# Altium project 10033E1.PrjPcb
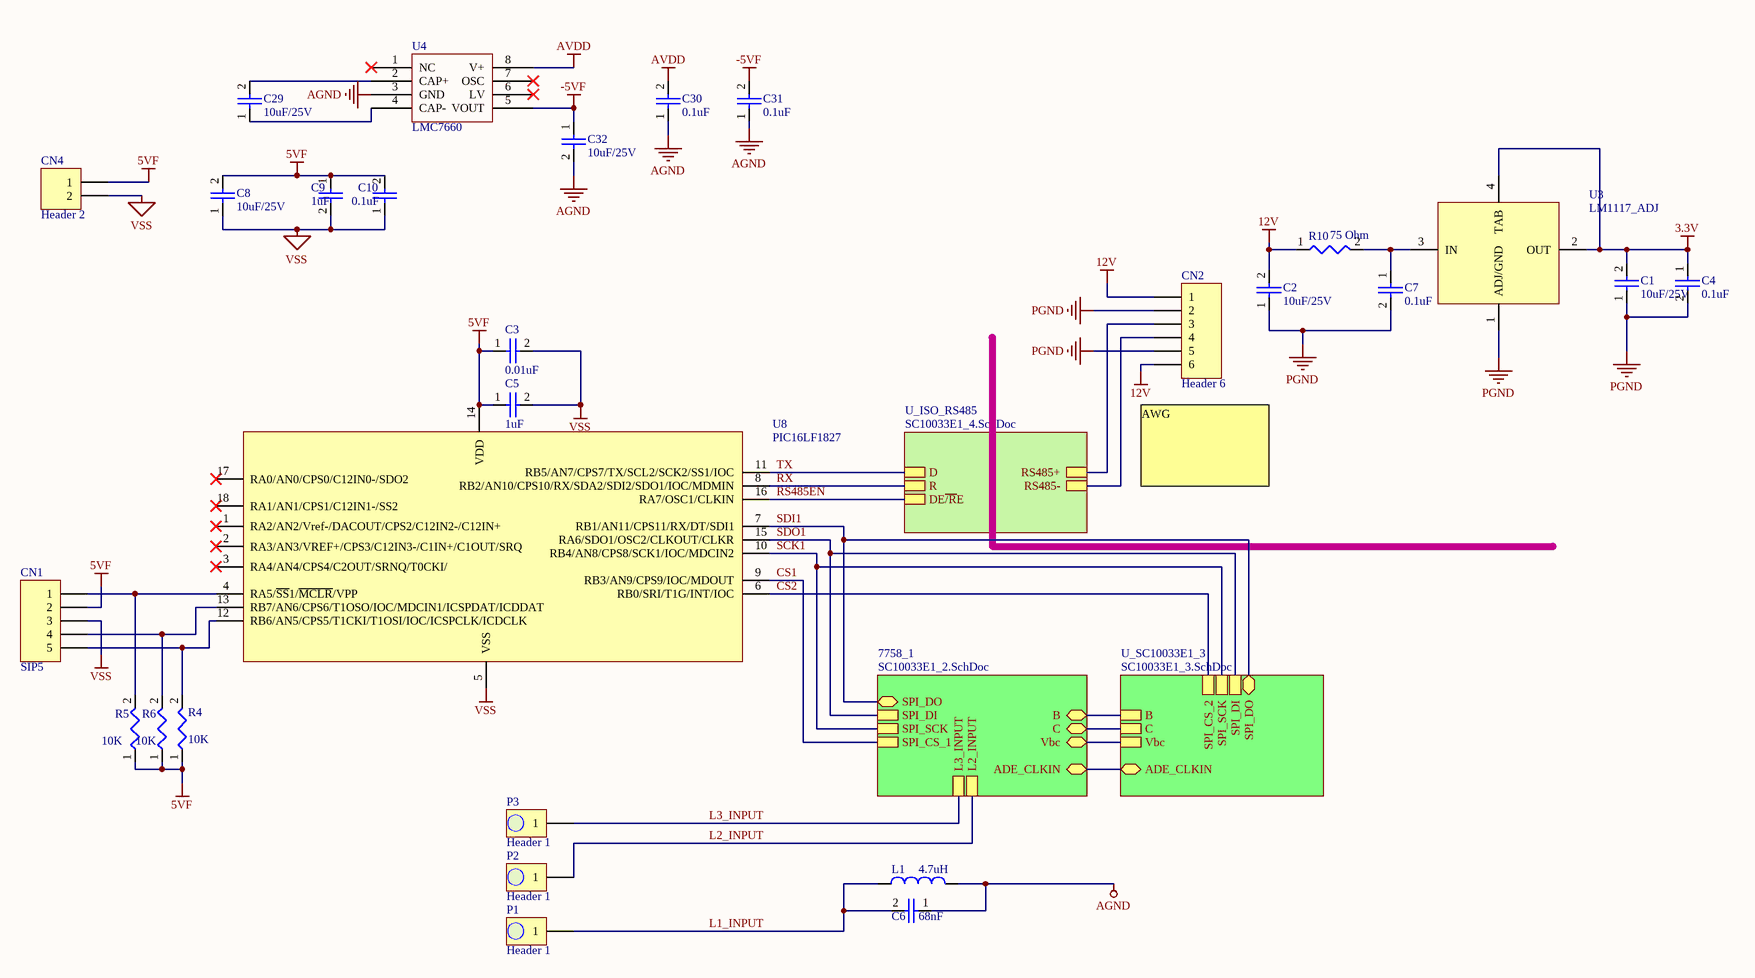
[diagram p0: SC10033E1.SchDoc]
Project: NA_Power_MeteredBoard_delta; PCB P/N: PB10033E1
4 sheets, 129 parts. Net scope: hierarchical (ports join the sheet entries above them; power ports are global).
Board file: PB10033E1.PcbDoc
Sheets:
  SC10033E1.SchDoc
    U_ISO_RS485 = SC10033E1_4.SchDoc
    7758_1 = SC10033E1_2.SchDoc
    U_SC10033E1_3 = SC10033E1_3.SchDoc

## Sheet SC10033E1.SchDoc: TOP
size A3; PCB PN: PB10013; PCBA PN: PA00013

### Parts
C1  value 10uF/25V  [C1206]  (hidden comment: CAP)
C2  value 10uF/25V  [C1206]  (hidden comment: CAP)
C3  value 0.01uF  [C0805]  (hidden comment: CAP)
C4  value 0.1uF  [C0805]  (hidden comment: CAP)
C5  value 1uF  [C0805]  (hidden comment: CAP)
C6  value 68nF  [C1206]  (hidden comment: CAP)
C7  value 0.1uF  [C0805]  (hidden comment: CAP)
C8  value 10uF/25V  [C1206]  (hidden comment: CAP)
C9  value 1uF  [C0805]  (hidden comment: CAP)
C10  value 0.1uF  [C0805]  (hidden comment: CAP)
C29  value 10uF/25V  [C1206]  (hidden comment: CAP)
C30  value 0.1uF  [C0805]  (hidden comment: CAP)
C31  value 0.1uF  [C0805]  (hidden comment: CAP)
C32  value 10uF/25V  [C1206]  (hidden comment: CAP)
CN1  SIP5  [SIP5]  (no BOM)
CN2  Header 6  [532590529-6P]
CN4  Header 2  [70551-2P]
L1  value 4.7uH  [L1008]  (hidden comment: Inductor)
P1  Header 1  (no BOM)
P2  Header 1  (no BOM)
P3  Header 1  (no BOM)
R4  value 10K  [R0603]  (hidden comment: RES)
R5  value 10K  [R0603]  (hidden comment: RES)
R6  value 10K  [R0603]  (hidden comment: RES)
R10  value 75 Ohm  [R2512]  (hidden comment: RES)
U3  LM1117_ADJ  [DPAK-134]
U4  LMC7660  [SOIC8]
U8  PIC16LF1827  [SO18]

### Sub-sheets
7758_1 = SC10033E1_2.SchDoc: L2_INPUT, L3_INPUT, SPI_DI, SPI_DO (bidir), SPI_SCK, SPI_CS_1, B, C, Vbc, ADE_CLKIN (bidir)
U_ISO_RS485 = SC10033E1_4.SchDoc: R, D, DE~{/R}E, RS485+, RS485-
U_SC10033E1_3 = SC10033E1_3.SchDoc: B, C, SPI_DI, SPI_DO (bidir), SPI_SCK, SPI_CS_2, ADE_CLKIN (bidir), Vbc

### Nets
3.3V: C1.2 C4.1 U3.2(OUT) U3.4(TAB)
5VF: C3.1 C5.1 C8.2 C9.1 C10.2 CN1.2 CN4.1 R4.1 R5.1 R6.1 U8.14(VDD)
12V: C2.2 CN2.1 CN2.6 R10.1
-5VF: C31.2 C32.1 U4.5(VOUT)
AGND: C6.1 C30.1 C31.1 C32.2 L1.2 U4.3(GND)
AVDD: C30.2 U4.8(V+)
PGND: C1.1 C2.1 C4.2 C7.2 CN2.2 CN2.5 U3.1(ADJ/GND)
VSS: C3.2 C5.2 C8.1 C9.2 C10.1 CN1.3 CN4.2 U8.5(VSS)
B: sheet 7758_1/B, sheet U_SC10033E1_3/B
C: sheet 7758_1/C, sheet U_SC10033E1_3/C
CS1: U8.9(RB3/AN9/CPS9/IOC/MDOUT) ; sheet 7758_1/SPI_CS_1
CS2: U8.6(RB0/SRI/T1G/INT/IOC) ; sheet U_SC10033E1_3/SPI_CS_2
L1_INPUT: C6.2 L1.1 P1.1
L2_INPUT: P2.1 ; sheet 7758_1/L2_INPUT
L3_INPUT: P3.1 ; sheet 7758_1/L3_INPUT
RS485EN: U8.16(RA7/OSC1/CLKIN) ; sheet U_ISO_RS485/DE~{/R}E
RX: U8.8(RB2/AN10/CPS10/RX/SDA2/SDI2/SDO1/IOC/MDMIN) ; sheet U_ISO_RS485/R
SCK1: U8.10(RB4/AN8/CPS8/SCK1/IOC/MDCIN2) ; sheet 7758_1/SPI_SCK, sheet U_SC10033E1_3/SPI_SCK
SDI1: U8.7(RB1/AN11/CPS11/RX/DT/SDI1) ; sheet 7758_1/SPI_DO, sheet U_SC10033E1_3/SPI_DO
SDO1: U8.15(RA6/SDO1/OSC2/CLKOUT/CLKR) ; sheet 7758_1/SPI_DI, sheet U_SC10033E1_3/SPI_DI
TX: U8.11(RB5/AN7/CPS7/TX/SCL2/SCK2/SS1/IOC) ; sheet U_ISO_RS485/D
Vbc: sheet 7758_1/Vbc, sheet U_SC10033E1_3/Vbc
NetC7_1: C7.1 R10.2 U3.3(IN)
NetC29_1: C29.1 U4.4(CAP-)
NetC29_2: C29.2 U4.2(CAP+)
NetC62_1: sheet 7758_1/ADE_CLKIN, sheet U_SC10033E1_3/ADE_CLKIN
NetCN1_1: CN1.1 R5.2 U8.4(RA5/~{SS}1/~{MCLR}/VPP)
NetCN1_4: CN1.4 R6.2 U8.13(RB7/AN6/CPS6/T1OSO/IOC/MDCIN1/ICSPDAT/ICDDAT)
NetCN1_5: CN1.5 R4.2 U8.12(RB6/AN5/CPS5/T1CKI/T1OSI/IOC/ICSPCLK/ICDCLK)
NetCN2_3: CN2.3 ; sheet U_ISO_RS485/RS485+
NetCN2_4: CN2.4 ; sheet U_ISO_RS485/RS485-

Not connected (* = marked no-connect by the designer): U4 1(NC)* 6(LV)* 7(OSC)*; U8 1(RA2/AN2/Vref-/DACOUT/CPS2/C12IN2-/C12IN+)* 2(RA3/AN3/VREF+/CPS3/C12IN3-/C1IN+/C1OUT/SRQ)* 3(RA4/AN4/CPS4/C2OUT/SRNQ/T0CKI/)* 17(RA0/AN0/CPS0/C12IN0-/SDO2)* 18(RA1/AN1/CPS1/C12IN1-/SS2)*

### Notes on the sheet
- (near CN2) AWG

### Library data of the parts
C1 C2 C8 C29 C32 = EC00088: CAP,CMCC,10uF,25V,10%,X7R,1206,SMD,ROHS; Manufacturer: Murata; Manufacturer P/N: GRM31CR71E106KA12L; ID: 88; Type: ****; HelpURL: \\192.168.1.3\Esh\Department\RD\CAD\Component\Capacitor\smd\Murata_GRM31CR71E106KA12L.pdf; P/N: EC00088
C3 = EC00018: CAP SMD CR X7R 50V 10% 10nF 0805 ROHS; Manufacturer: Murata; Manufacturer P/N: GRM216R71H103KA01D; ID: 18; HelpURL: *; P/N: EC00018
C4 C7 C10 = EC00078: CAP SMD CR X7R 50V 10% 0.1uF 0805 ROHS; Manufacturer: Murata; Manufacturer P/N: GRM21BR71H104KA01; ID: 78; Type: ****; HelpURL: \\192.168.1.3\Esh\Department\RD\CAD\Component\Capacitor\smd\Murata_GRM21BR71H104KA01#.pdf; P/N: EC00078
C5 = EC00002: CAP SMD CR X7R 50V 10% 1uF 0805 ROHS; Manufacturer: YAGEO; Manufacturer P/N: CC0805KKX7R9BB105; ID: 2; HelpURL: *; P/N: EC00002
C6 = EC00059: CAP SMD C0G 50V 5% 68nF 1206 ROHS; Manufacturer: Murata; Manufacturer P/N: GRM31C5C1H683JA01L; ID: 59; HelpURL: *; P/N: EC00059
C9 = EC00055: CAP SMD CR X7R 50V 10% 1uF 0805 ROHS; Manufacturer: Murata; Manufacturer P/N: GRM21BR71H105KA12L; ID: 55; HelpURL: *; P/N: EC00055
C30 C31 = EC00014: CAP SMD CR X7R 50V 10% 0.1uF 0805 ROHS; Manufacturer: YAGEO; Manufacturer P/N: CC0805KRX7R9BB104; ID: 14; HelpURL: *; P/N: EC00014
CN1 = EJ00017: CONNECTOR 5PIN,2.54PITCH,SIP-5; Manufacturer: 信荣; Manufacturer P/N: PH2.54*1*5*11.6/3.0; ID: 17; P/N: EJ00017; Value: SIP-5
CN2 = EJ00053: CONNECTOR 6PIN,3.5PITCH,PTH,ROHS; Manufacturer P/N: 532590629; Manufacturer: MOLEX; ID: 53; Value: 532590629; HelpURL: \\192.168.1.3\Esh\Department\RD\CAD\Component\connector\molex\532590529_sd.pdf; P/N: EJ00053; Type: *****
CN4 = EJ00051: CONNECTOR 2PIN,2.54PITCH,90 Degrees,PTH; Manufacturer P/N: 705510001; Manufacturer: MOLEX; ID: 51; Value: 705510001; HelpURL: \\192.168.1.3\Esh\Department\RD\CAD\Component\connector\molex\705510004.pdf; P/N: EJ00051
L1 = EL00009: INDUCTOR 4.7uH 0.45A 5%,SRF = 50MHz,Q = 26, SMD 1008 ROHS; Manufacturer: Wuerth Electronic; Manufacturer P/N: 74479887247; ID: 9; Type: ****; HelpURL: \\192.168.1.3\Esh\Department\RD\CAD\Component\Inductor\WE_74479887247.pdf; P/N: EL00009
P1-P3 = Header 1: Header, 1-Pin
R4-R6 = ER00213: RES THICK_FILM SMD 10K ohm 5% 1/10W ROHS 0603; Manufacturer: YAGEO; Manufacturer P/N: RC0603JR-1310KL; ID: 213; HelpURL: \\192.168.1.3\Esh\Department\RD\CAD\Component\Resistor\SMD\YAGEO_PYu-RC1206_51_RoHS_L_4.pdf; P/N: ER00213
R10 = ER00212: RES THICK_FILM SMD 75 ohm 5% 1W ROHS 2512; Manufacturer: YAGEO; Manufacturer P/N: RC2512JK-0775RL; ID: 212; HelpURL: \\192.168.1.3\Esh\Department\RD\CAD\Component\Resistor\SMD\YAGEO_PYu-RC1206_51_RoHS_L_4.pdf; P/N: ER00212
U3 = EU00066: IC REG VOLT +3.3V LDO 800MA DPAK ROHS; Manufacturer P/N: LD1117DT33TR; Manufacturer: ST; ID: 66; Value: LD1117-3.3; HelpURL: \\192.168.1.3\Esh\Department\RD\CAD\Component\Power_DC_to_DC\LD1117_ST.pdf; P/N: EU00066; Type: *****
U4 = EU00046: IC CMOS Voltage Converters; Manufacturer P/N: LMC7660IM; Manufacturer: National Semiconductor; ID: 46; Value: LMC7660IM; HelpURL: \\192.168.1.3\Esh\Department\RD\CAD\Component\Power_DC_to_DC\LMC7660.pdf; P/N: EU00046; Type: *****
U8 = EU00033: IC 8-bit UART SPI I2C,SOIC18-W,SMD,ROHS; Manufacturer P/N: PIC16F1827-I/SO; Manufacturer: Microchip; ID: 33; Value: PIC16F1827-I/SO; HelpURL: \\192.168.1.3\Esh\Department\RD\CAD\Component\MCU\PIC16F1827.pdf; P/N: EU00033; Type: *****

## Sheet SC10033E1_4.SchDoc
size A4
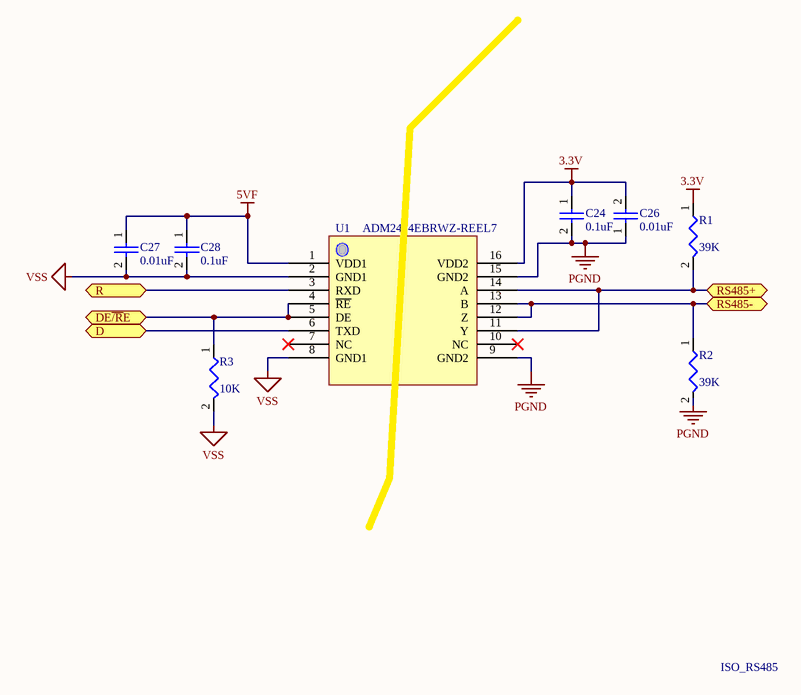
[diagram p1: SC10033E1_4.SchDoc]

### Parts
C24  value 0.1uF  [C0805]  (hidden comment: CAP)
C26  value 0.01uF  [C0805]  (hidden comment: CAP)
C27  value 0.01uF  [C0805]  (hidden comment: CAP)
C28  value 0.1uF  [C0805]  (hidden comment: CAP)
R1  value 39K  [R0805]  (hidden comment: RES)
R2  value 39K  [R0805]  (hidden comment: RES)
R3  value 10K  [R0805]  (hidden comment: RES)
U1  value ADM2484EBRWZ-REEL7  [SOIC16]  (hidden comment: ADM2484E)

### Ports
D, DE~{/R}E, R, RS485+, RS485-

### Nets
3.3V: C24.1 C26.2 R1.1 U1.16(VDD2)
5VF: C27.1 C28.1 U1.1(VDD1)
PGND: C24.2 C26.1 R2.2 U1.9(GND2) U1.15(GND2)
VSS: C27.2 C28.2 R3.2 U1.2(GND1) U1.8(GND1)
RS485EN: R3.1 U1.4(~{RE}) U1.5(DE) ; port DE~{/R}E
RX: U1.3(RXD) ; port R
TX: U1.6(TXD) ; port D
NetCN2_3: R1.2 U1.11(Y) U1.14(A) ; port RS485+
NetCN2_4: R2.1 U1.12(Z) U1.13(B) ; port RS485-

Not connected (* = marked no-connect by the designer): U1 7(NC)* 10(NC)*

### Notes on the sheet
- ISO_RS485

### Library data of the parts
C24 C28 = EC00014: as C30 on sheet SC10033E1; HelpURL: *; P/N: EC00014
C26 C27 = EC00037: CAP SMD X7R 50V 10% 10nF 0805 ROHS; Manufacturer: YAGEO; Manufacturer P/N: CC0805KRX7R9BB103; ID: 37; HelpURL: *; P/N: EC00037
R1 R2 = ER00021: RES THICK_FILM SMD 39K 5% 1/8W ROHS 0805; Manufacturer: YAGEO; Manufacturer P/N: RC0805JR-0739KL; ID: 21; HelpURL: *; P/N: ER00021
R3 = ER00031: RES THICK_FILM SMD 10K 5% 1/8W ROHS 0805; Manufacturer: YAGEO; Manufacturer P/N: RC0805JR-0710KL; ID: 31; HelpURL: *; P/N: ER00031
U1 = EU00059: IC Isolated, RS-485/RS-422 transceiver,5kV,SOIC16_W,ROHS; Manufacturer: Analog Devices; Pin Number: 16; ID: 59; HelpURL: \\192.168.1.3\Esh\Department\RD\CAD\Component\RS485\ADM2484E.pdf; P/N: EU00059; Manufacturer P/N: ADM2484EBRWZ-REEL7; Type: *****

## Sheet SC10033E1_2.SchDoc: Meter_1
size A3
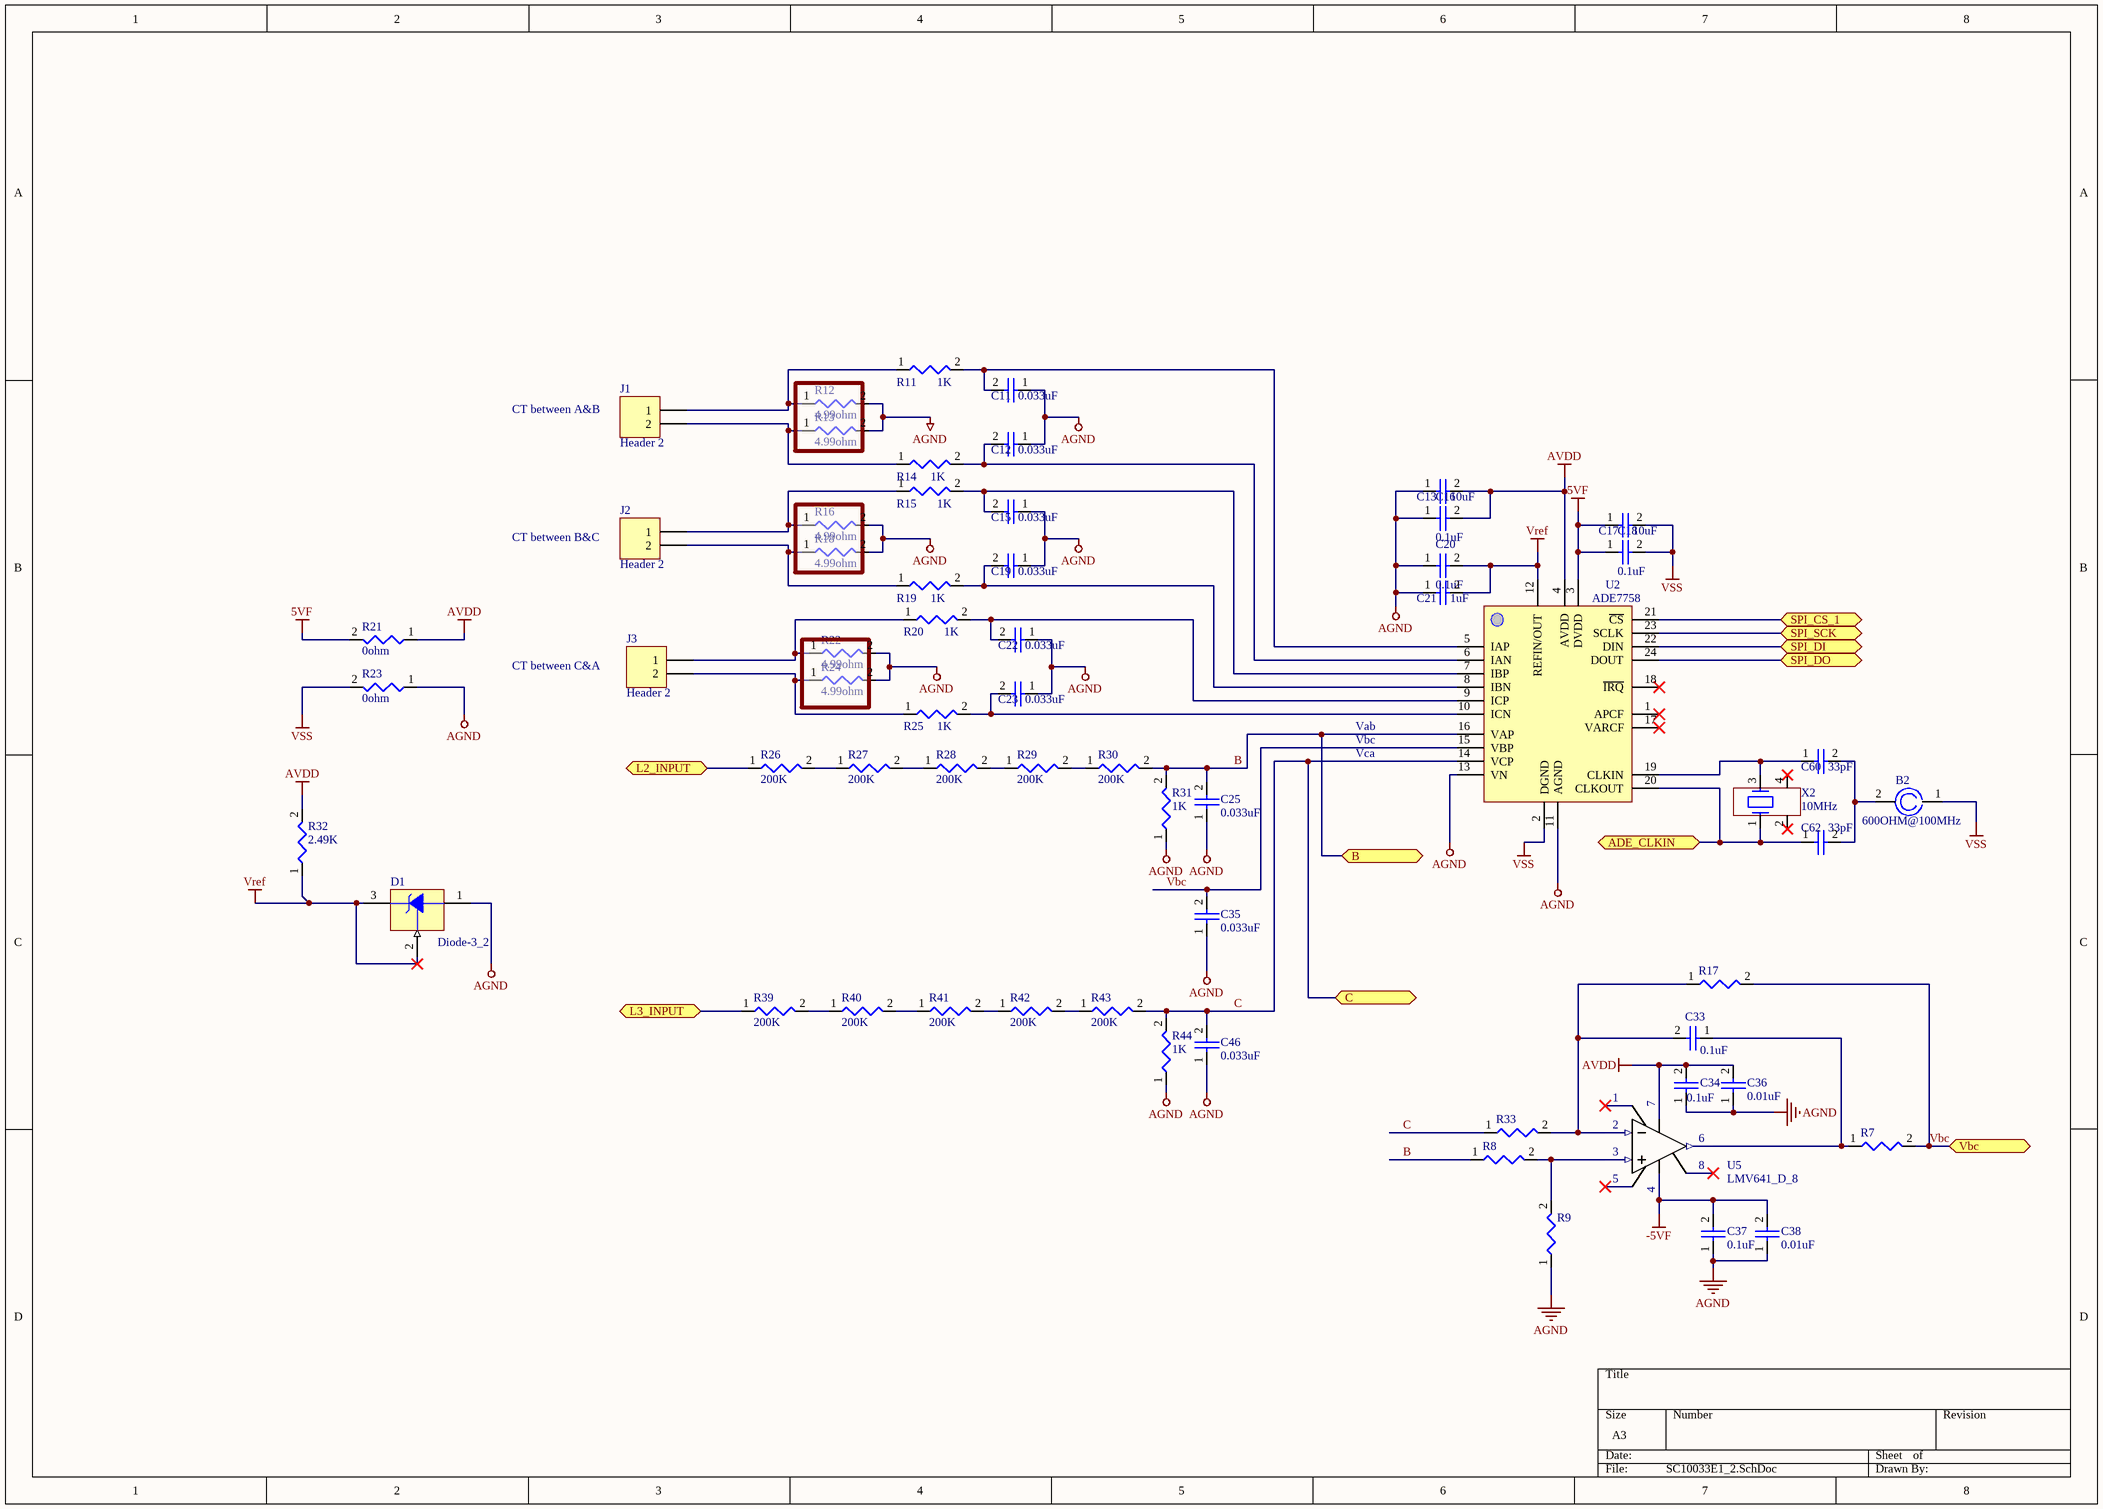
[diagram p2: SC10033E1_2.SchDoc]

### Parts
B2  value 600OHM@100MHz  [L0805]  (hidden comment: FERRITE)
C11  value 0.033uF  [C0805]  (hidden comment: CAP)
C12  value 0.033uF  [C0805]  (hidden comment: CAP)
C13  10uF  [C0805]
C15  value 0.033uF  [C0805]  (hidden comment: CAP)
C16  value 0.1uF  [C0805]  (hidden comment: CAP)
C17  10uF  [C0805]
C18  value 0.1uF  [C0805]  (hidden comment: CAP)
C19  value 0.033uF  [C0805]  (hidden comment: CAP)
C20  value 0.1uF  [C0805]  (hidden comment: CAP)
C21  value 1uF  [C0805]  (hidden comment: CAP)
C22  value 0.033uF  [C0805]  (hidden comment: CAP)
C23  value 0.033uF  [C0805]  (hidden comment: CAP)
C25  value 0.033uF  [C0805]  (hidden comment: CAP)
C33  value 0.1uF  [C0805]  (hidden comment: CAP)  (no BOM)
C34  value 0.1uF  [C0805]  (hidden comment: CAP)
C35  value 0.033uF  [C0805]  (hidden comment: CAP)
C36  value 0.01uF  [C0805]  (hidden comment: CAP)
C37  value 0.1uF  [C0805]  (hidden comment: CAP)
C38  value 0.01uF  [C0805]  (hidden comment: CAP)
C46  value 0.033uF  [C0805]  (hidden comment: CAP)
C60  value 33pF  [C0805]  (hidden comment: CAP)
C62  value 33pF  [C0805]  (hidden comment: CAP)
D1  Diode-3_2  [SOT23-321]
J1  Header 2  [533980271_sd]
J2  Header 2  [533980271_sd]
J3  Header 2  [533980271_sd]
R7  RES  [R0805]  (value not drawn)
R8  RES  [R0603]  (value not drawn)
R9  RES  [R0603]  (value not drawn)
R11  value 1K  [R0805]  (hidden comment: RES)
R12  value 4.99ohm  [R0805]  (hidden comment: RES)
R13  value 4.99ohm  [R0805]  (hidden comment: RES)
R14  value 1K  [R0805]  (hidden comment: RES)
R15  value 1K  [R0805]  (hidden comment: RES)
R16  value 4.99ohm  [R0805]  (hidden comment: RES)
R17  RES  [R0603]  (value not drawn)
R18  value 4.99ohm  [R0805]  (hidden comment: RES)
R19  value 1K  [R0805]  (hidden comment: RES)
R20  value 1K  [R0805]  (hidden comment: RES)
R21  value 0ohm  [R0805]  (hidden comment: RES)
R22  value 4.99ohm  [R0805]  (hidden comment: RES)
R23  value 0ohm  [R0805]  (hidden comment: RES)
R24  value 4.99ohm  [R0805]  (hidden comment: RES)
R25  value 1K  [R0805]  (hidden comment: RES)
R26  value 200K  [R0805]  (hidden comment: RES)
R27  value 200K  [R0805]  (hidden comment: RES)
R28  value 200K  [R0805]  (hidden comment: RES)
R29  value 200K  [R0805]  (hidden comment: RES)
R30  value 200K  [R0805]  (hidden comment: RES)
R31  value 1K  [R0805]  (hidden comment: RES)
R32  value 2.49K  [R0805]  (hidden comment: RES)
R33  RES  [R0603]  (value not drawn)
R39  value 200K  [R0805]  (hidden comment: RES)
R40  value 200K  [R0805]  (hidden comment: RES)
R41  value 200K  [R0805]  (hidden comment: RES)
R42  value 200K  [R0805]  (hidden comment: RES)
R43  value 200K  [R0805]  (hidden comment: RES)
R44  value 1K  [R0805]  (hidden comment: RES)
U2  ADE7758  [SOIC24-W]
U5  LMV641_D_8  [M08A]
X2  value 10MHz  [XTAL_5X3_2]  (hidden comment: ABM3C)

### Ports
ADE_CLKIN (bidir), B, C, L2_INPUT, L3_INPUT, SPI_CS_1, SPI_DI, SPI_DO (bidir), SPI_SCK, Vbc

### Nets
5VF: C17.1 C18.1 R21.2 U2.3(DVDD)
-5VF: C37.2 C38.2 U5.4(V-)
AGND: C11.1 C12.1 C13.1 C15.1 C16.1 C19.1 C20.1 C21.1 C22.1 C23.1 C25.1 C34.1 C35.1 C36.1 C37.1 C38.1 C46.1 D1.1(A) R9.1 R12.2 R13.2 R16.2 R18.2 R22.2 R23.1 R24.2 R31.1 R44.1 U2.11(AGND) U2.13(VN)
AVDD: C13.2 C16.2 C34.2 C36.2 R21.1 R32.2 U2.4(AVDD) U5.7(V+)
Vref: C20.2 C21.2 D1.2(R) D1.3(C) R32.1 U2.12(REFIN/OUT)
VSS: B2.1 C17.2 C18.2 R23.2 U2.2(DGND)
B: C25.2 R8.1 R30.2 R31.2 U2.16(VAP) ; port B
C: C46.2 R33.1 R43.2 R44.2 U2.14(VCP) ; port C
CS1: U2.21(~{CS}) ; port SPI_CS_1
L2_INPUT: R26.1 ; port L2_INPUT
L3_INPUT: R39.1 ; port L3_INPUT
SCK1: U2.23(SCLK) ; port SPI_SCK
SDI1: U2.24(DOUT) ; port SPI_DO
SDO1: U2.22(DIN) ; port SPI_DI
Vbc: C35.2 R7.2 R17.2 U2.15(VBP) ; port Vbc
NetB2_2: B2.2 C60.2 C62.2
NetC11_2: C11.2 R11.2 U2.5(IAP)
NetC12_2: C12.2 R14.2 U2.6(IAN)
NetC15_2: C15.2 R15.2 U2.7(IBP)
NetC19_2: C19.2 R19.2 U2.8(IBN)
NetC22_2: C22.2 R20.2 U2.9(ICP)
NetC23_2: C23.2 R25.2 U2.10(ICN)
NetC33_1: C33.1 R7.1 U5.6(OUT)
NetC33_2: C33.2 R17.1 R33.2 U5.2(IN-)
NetC60_1: C60.1 U2.19(CLKIN) X2.3
NetC62_1: C62.1 U2.20(CLKOUT) X2.1 ; port ADE_CLKIN
NetJ1_1: J1.1 R11.1 R12.1
NetJ1_2: J1.2 R13.1 R14.1
NetJ2_1: J2.1 R15.1 R16.1
NetJ2_2: J2.2 R18.1 R19.1
NetJ3_1: J3.1 R20.1 R22.1
NetJ3_2: J3.2 R24.1 R25.1
NetR8_2: R8.2 R9.2 U5.3(IN+)
NetR26_2: R26.2 R27.1
NetR27_2: R27.2 R28.1
NetR28_2: R28.2 R29.1
NetR29_2: R29.2 R30.1
NetR39_2: R39.2 R40.1
NetR40_2: R40.2 R41.1
NetR41_2: R41.2 R42.1
NetR42_2: R42.2 R43.1

Not connected (* = marked no-connect by the designer): U2 1(APCF)* 17(VARCF)* 18(~{IRQ})*; U5 1(NC)* 5(NC_3)* 8(NC_2)*; X2 2* 4*

### Notes on the sheet
- CT between A&B
- CT between B&C
- CT between C&A
- Vab
- Vbc
- Vca

### Library data of the parts
B2 = EL00002: Ferrite Bead 600OHM@100MHz 200mA SMD 0805 ROHS; Manufacturer: Wuerth Electronic; Manufacturer P/N: 742792041; ID: 2; HelpURL: \\192.168.1.3\Esh\Department\RD\CAD\Component\Ferrite Bead\WE_742792041.pdf; P/N: EL00002; Type: ****
C11 C12 C15 C19 C22 C23 C25 C35 C46 = EC00079: CAP SMD X7R 50V 10% 0.033uF 0805 ROHS; Manufacturer: Murata; Manufacturer P/N: GRM219R71H333KA01; ID: 79; HelpURL: \\192.168.1.3\Esh\Department\RD\CAD\Component\Capacitor\smd\Murata_mpdf.pdf; P/N: EC00079
C13 C17 = EC00034: CAP SMD CR X5R 16V 10% 10uF 0805 ROHS; Manufacturer: Murata; Manufacturer P/N: GRM21BR61C106KE15; Value: 10uF_16V; ID: 34; Type: ****; HelpURL: *; P/N: EC00034
C16 C18 C20 = EC00014: as C30 on sheet SC10033E1; HelpURL: *; P/N: EC00014
C21 = EC00002: as C5 on sheet SC10033E1; HelpURL: *; P/N: EC00002
C33 C34 C37 = EC00078: as C4 on sheet SC10033E1; HelpURL: \\192.168.1.3\Esh\Department\RD\CAD\Component\Capacitor\smd\Murata_GRM21BR71H104KA01#.pdf; P/N: EC00078
C36 C38 = EC00018: as C3 on sheet SC10033E1; HelpURL: *; P/N: EC00018
C60 C62 = EC00017: CAP SMD C0G 50V 5% 33pF 0805 ROHS; Manufacturer: YAGEO; Manufacturer P/N: CC0805JRNPO9BN330; ID: 17; HelpURL: \\192.168.1.3\Esh\Department\RD\CAD\Component\Capacitor\smd\Murata_GQM2195C1H330JB01D.pdf; P/N: EC00017
D1 = EU00043: IC PROGRAMMABLE PRECISION REFERENCES,2.5-20V,0.5%,SMD,ROHS; Manufacturer: DIODES; Manufacturer P/N: ZTL431BFTA; ID: 43; Value: ZTL431BFTA; Type: *****; HelpURL: \\192.168.1.3\Esh\Department\RD\CAD\Component\TL431\ZTL431_432.pdf; P/N: EU00043
J1-J3 = EJ00039: CONNECTOR 1.25mm Pitch Header, Surface Mount, Vertical, Lead-Free, 2 Circuits; Manufacturer: MOLEX; ID: 39; Value: 533980271; HelpURL: \\192.168.1.3\Esh\Department\RD\CAD\Component\connector\molex\533980271_sd.pdf; P/N: EJ00039; Manufacturer P/N: 533980271
R7 = ER00026: RES THICK_FILM SMD 0 OHM 5% 1/8W ROHS 0805; Manufacturer: YAGEO; Manufacturer P/N: RC0805JR-070RL; Value: 0ohm; ID: 26; HelpURL: *; P/N: ER00026
R8 R9 R17 R33 = ER00211: RES THIN_FILM SMD 10K 0.1% 1/10W ±25ppm/℃ ROHS 0603; Manufacturer: YAGEO; Manufacturer P/N: RT0603BRD0710KL; ID: 211; HelpURL: \\192.168.1.3\Esh\Department\RD\CAD\Component\Resistor\SMD\YAGEO_PYu-RT_1-to-0.05_RoHS_L_4.pdf; Value: 10K; P/N: ER00211
R11 R14 R15 R19 R20 R25 = ER00028: RES THICK_FILM SMD 1K 1% 1/8W ROHS 0805; Manufacturer: YAGEO; Manufacturer P/N: RC0805FR-071KL; ID: 28; HelpURL: *; P/N: ER00028
R12 R13 R16 R18 R22 R24 = ER00201: RES THIN_FILM SMD 4.99 ohm 0.1% 1/8W ±25ppm/℃ ROHS 0805; Manufacturer: YAGEO; Manufacturer P/N: RT0805BRD074R99L; ID: 201; HelpURL: *; P/N: ER00201
R21 R23 = ER00026: RES THICK_FILM SMD 0 OHM 5% 1/8W ROHS 0805; Manufacturer: YAGEO; Manufacturer P/N: RC0805JR-070RL; ID: 26; HelpURL: *; P/N: ER00026
R26-R30 R39-R43 = ER00036: RES THIN_FILM SMD 200K 0.1% 1/8W 25PPM ROHS 0805; Manufacturer: YAGEO; Manufacturer P/N: RT0805BRD07200KL; ID: 36; HelpURL: *; P/N: ER00036
R31 R44 = ER00110: RES THIN_FILM 1K 0.1% 1/8W ±25ppm/℃ ROHS SMD 0805; Manufacturer: YAGEO; Manufacturer P/N: RT0805BRD071KL; ID: 110; HelpURL: \\192.168.1.3\Esh\Department\RD\CAD\Component\Resistor\SMD\YAGEO_PYu-RT_1-to-0.05_RoHS_L_4.pdf; P/N: ER00110
R32 = ER00108: RES THICK_FILM 2.49K 1% 1/8W ROHS SMD 0805; Manufacturer: YAGEO; Manufacturer P/N: RC0805FR-072K49L; ID: 108; HelpURL: *; P/N: ER00108
U2 = EU00042: IC Energy Measurement,Irms,VA,VAR,Vrms,Watt,Output:Pulsed&SPI,SOIC_W-24,ROHS; Manufacturer P/N: ADE7758ARWZRL; Manufacturer: ANALOG DEVICES; ID: 42; Value: ADE7758ARWZRL; HelpURL: \\192.168.1.3\Esh\Department\RD\CAD\Component\Energy Measurement\ADE7758.pdf; P/N: EU00042; Type: *****
U5 = EU00065: Op Amp,10MHz,12V,Low Power,SOIC-8,RoHS; Manufacturer P/N: LMV641MAE/NOPB; Manufacturer: TI; ID: 65; Value: LMV641MAE/NOPB; HelpURL: \\192.168.1.3\Esh\Department\RD\CAD\Component\OP\lmv641.pdf; P/N: EU00065; Type: *****
X2 = EX00008: XTAL 10MHz 18PF +/-30PPM,3.2mmWx5mmLx1.3mmH,-40~85,RoHS,SMD; Manufacturer: ABRACON; Manufacturer P/N: ABM3C-10.000MHZ-D4Y-T; ID: 8; HelpURL: \\192.168.1.3\Esh\Department\RD\CAD\Component\Crystal\abracon_abm3c.pdf; P/N: EX00008; Type: *****

## Sheet SC10033E1_3.SchDoc: Meter_2
size A3
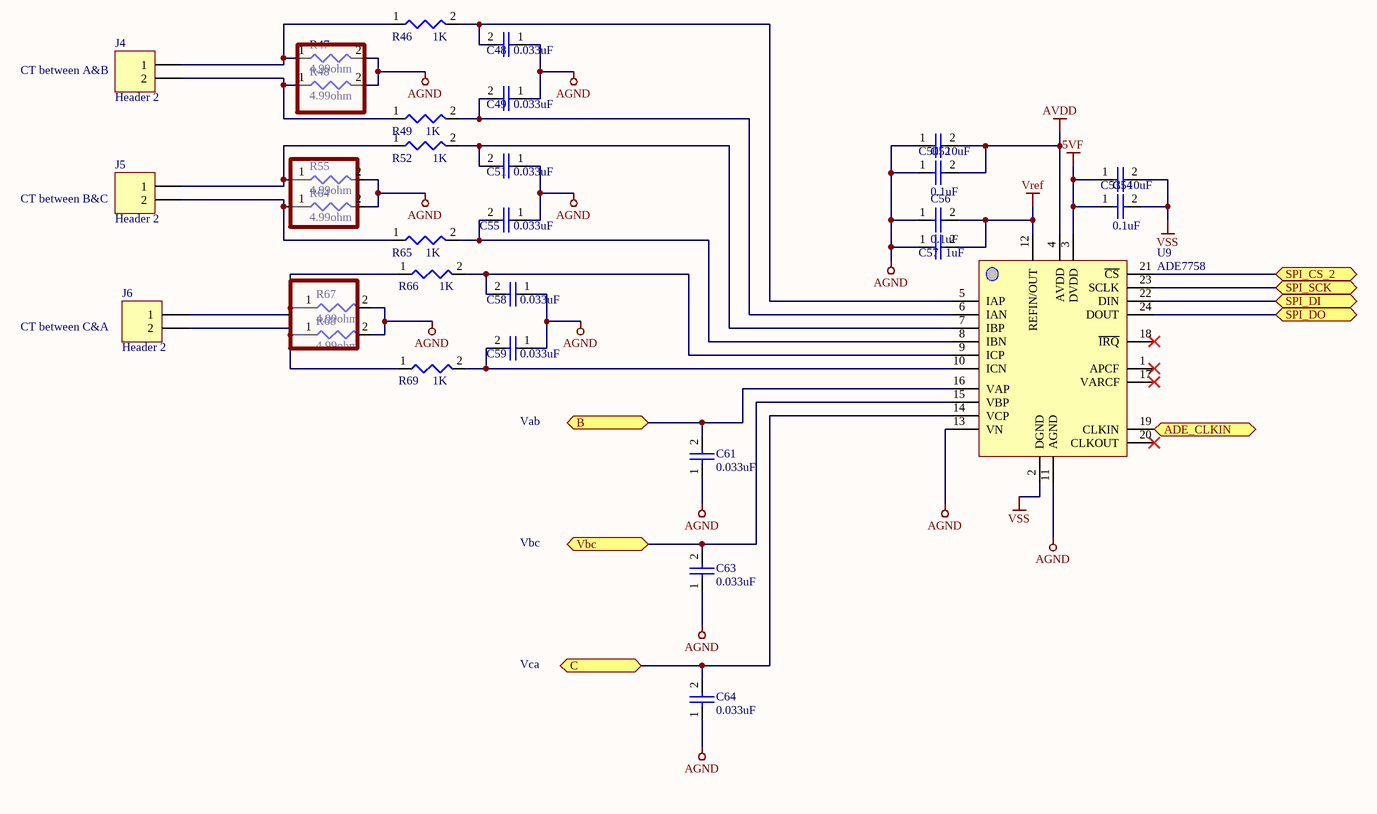
[diagram p3: SC10033E1_3.SchDoc]

### Parts
C48  value 0.033uF  [C0805]  (hidden comment: CAP)
C49  value 0.033uF  [C0805]  (hidden comment: CAP)
C50  10uF  [C0805]
C51  value 0.033uF  [C0805]  (hidden comment: CAP)
C52  value 0.1uF  [C0805]  (hidden comment: CAP)
C53  10uF  [C0805]
C54  value 0.1uF  [C0805]  (hidden comment: CAP)
C55  value 0.033uF  [C0805]  (hidden comment: CAP)
C56  value 0.1uF  [C0805]  (hidden comment: CAP)
C57  value 1uF  [C0805]  (hidden comment: CAP)
C58  value 0.033uF  [C0805]  (hidden comment: CAP)
C59  value 0.033uF  [C0805]  (hidden comment: CAP)
C61  value 0.033uF  [C0805]  (hidden comment: CAP)
C63  value 0.033uF  [C0805]  (hidden comment: CAP)
C64  value 0.033uF  [C0805]  (hidden comment: CAP)
J4  Header 2  [533980271_sd]
J5  Header 2  [533980271_sd]
J6  Header 2  [533980271_sd]
R46  value 1K  [R0805]  (hidden comment: RES)
R47  value 4.99ohm  [R0805]  (hidden comment: RES)
R48  value 4.99ohm  [R0805]  (hidden comment: RES)
R49  value 1K  [R0805]  (hidden comment: RES)
R52  value 1K  [R0805]  (hidden comment: RES)
R55  value 4.99ohm  [R0805]  (hidden comment: RES)
R64  value 4.99ohm  [R0805]  (hidden comment: RES)
R65  value 1K  [R0805]  (hidden comment: RES)
R66  value 1K  [R0805]  (hidden comment: RES)
R67  value 4.99ohm  [R0805]  (hidden comment: RES)
R68  value 4.99ohm  [R0805]  (hidden comment: RES)
R69  value 1K  [R0805]  (hidden comment: RES)
U9  ADE7758  [SOIC24-W]

### Ports
ADE_CLKIN (bidir), B, C, SPI_CS_2, SPI_DI, SPI_DO (bidir), SPI_SCK, Vbc

### Nets
5VF: C53.1 C54.1 U9.3(DVDD)
AGND: C48.1 C49.1 C50.1 C51.1 C52.1 C55.1 C56.1 C57.1 C58.1 C59.1 C61.1 C63.1 C64.1 R47.2 R48.2 R55.2 R64.2 R67.2 R68.2 U9.11(AGND) U9.13(VN)
AVDD: C50.2 C52.2 U9.4(AVDD)
Vref: C56.2 C57.2 U9.12(REFIN/OUT)
VSS: C53.2 C54.2 U9.2(DGND)
B: C61.2 U9.16(VAP) ; port B
C: C64.2 U9.14(VCP) ; port C
CS2: U9.21(~{CS}) ; port SPI_CS_2
SCK1: U9.23(SCLK) ; port SPI_SCK
SDI1: U9.24(DOUT) ; port SPI_DO
SDO1: U9.22(DIN) ; port SPI_DI
Vbc: C63.2 U9.15(VBP) ; port Vbc
NetC48_2: C48.2 R46.2 U9.5(IAP)
NetC49_2: C49.2 R49.2 U9.6(IAN)
NetC51_2: C51.2 R52.2 U9.7(IBP)
NetC55_2: C55.2 R65.2 U9.8(IBN)
NetC58_2: C58.2 R66.2 U9.9(ICP)
NetC59_2: C59.2 R69.2 U9.10(ICN)
NetC62_1: U9.19(CLKIN) ; port ADE_CLKIN
NetJ4_1: J4.1 R46.1 R47.1
NetJ4_2: J4.2 R48.1 R49.1
NetJ5_1: J5.1 R52.1 R55.1
NetJ5_2: J5.2 R64.1 R65.1
NetJ6_1: J6.1 R66.1 R67.1
NetJ6_2: J6.2 R68.1 R69.1

Not connected (* = marked no-connect by the designer): U9 1(APCF)* 17(VARCF)* 18(~{IRQ})* 20(CLKOUT)*

### Notes on the sheet
- (near J4) CT between A&B
- (near J5) CT between B&C
- CT between C&A
- Vab
- Vbc
- Vca

### Library data of the parts
C48 C49 C51 C55 C58 C59 C61 C63 C64 = EC00079: as C11 on sheet SC10033E1_2; HelpURL: \\192.168.1.3\Esh\Department\RD\CAD\Component\Capacitor\smd\Murata_mpdf.pdf; P/N: EC00079
C50 C53 = EC00034: as C13 on sheet SC10033E1_2; HelpURL: *; P/N: EC00034
C52 C54 C56 = EC00014: as C30 on sheet SC10033E1; HelpURL: *; P/N: EC00014
C57 = EC00002: as C5 on sheet SC10033E1; HelpURL: *; P/N: EC00002
J4-J6 = EJ00039: as J1 on sheet SC10033E1_2; HelpURL: \\192.168.1.3\Esh\Department\RD\CAD\Component\connector\molex\533980271_sd.pdf; P/N: EJ00039; Manufacturer P/N: 533980271
R46 R49 R52 R65 R66 R69 = ER00028: as R11 on sheet SC10033E1_2; HelpURL: *; P/N: ER00028
R47 R48 R55 R64 R67 R68 = ER00201: as R12 on sheet SC10033E1_2; HelpURL: *; P/N: ER00201
U9 = EU00042: as U2 on sheet SC10033E1_2; HelpURL: \\192.168.1.3\Esh\Department\RD\CAD\Component\Energy Measurement\ADE7758.pdf; P/N: EU00042; Type: *****

## Nets that join several sheets
3.3V: SC10033E1 (C1.2 C4.1 U3.2 U3.4), SC10033E1_4 (C24.1 C26.2 R1.1 U1.16)
5VF: SC10033E1 (11 pins), SC10033E1_4 (C27.1 C28.1 U1.1), SC10033E1_2 (C17.1 C18.1 R21.2 U2.3), SC10033E1_3 (C53.1 C54.1 U9.3)
-5VF: SC10033E1 (C31.2 C32.1 U4.5), SC10033E1_2 (C37.2 C38.2 U5.4)
AGND: SC10033E1 (6 pins), SC10033E1_2 (30 pins), SC10033E1_3 (21 pins)
AVDD: SC10033E1 (C30.2 U4.8), SC10033E1_2 (8 pins), SC10033E1_3 (C50.2 C52.2 U9.4)
PGND: SC10033E1 (7 pins), SC10033E1_4 (5 pins)
Vref: SC10033E1_2 (6 pins), SC10033E1_3 (C56.2 C57.2 U9.12)
VSS: SC10033E1 (8 pins), SC10033E1_4 (5 pins), SC10033E1_2 (5 pins), SC10033E1_3 (C53.2 C54.2 U9.2)
B: SC10033E1_2 (5 pins), SC10033E1_3 (C61.2 U9.16)
C: SC10033E1_2 (5 pins), SC10033E1_3 (C64.2 U9.14)
CS1: SC10033E1 (U8.9), SC10033E1_2 (U2.21)
CS2: SC10033E1 (U8.6), SC10033E1_3 (U9.21)
L2_INPUT: SC10033E1 (P2.1), SC10033E1_2 (R26.1)
L3_INPUT: SC10033E1 (P3.1), SC10033E1_2 (R39.1)
NetC62_1: SC10033E1_2 (C62.1 U2.20 X2.1), SC10033E1_3 (U9.19)
NetCN2_3: SC10033E1 (CN2.3), SC10033E1_4 (R1.2 U1.11 U1.14)
NetCN2_4: SC10033E1 (CN2.4), SC10033E1_4 (R2.1 U1.12 U1.13)
RS485EN: SC10033E1 (U8.16), SC10033E1_4 (R3.1 U1.4 U1.5)
RX: SC10033E1 (U8.8), SC10033E1_4 (U1.3)
SCK1: SC10033E1 (U8.10), SC10033E1_2 (U2.23), SC10033E1_3 (U9.23)
SDI1: SC10033E1 (U8.7), SC10033E1_2 (U2.24), SC10033E1_3 (U9.24)
SDO1: SC10033E1 (U8.15), SC10033E1_2 (U2.22), SC10033E1_3 (U9.22)
TX: SC10033E1 (U8.11), SC10033E1_4 (U1.6)
Vbc: SC10033E1_2 (C35.2 R7.2 R17.2 U2.15), SC10033E1_3 (C63.2 U9.15)

## Assembly variants
NA_Power_MeteredBoard_delta_6J: not fitted C33 CN1 P1 P2 P3
NA_Power_MeteredBoard_delta_3J: not fitted C33 C48 C49 C50 C51 C52 C53 C54 C55 C56 C57 C58 C59 C61 C63 C64 CN1 J4 J5 J6 P1 P2 P3 R46 R47 R48 R49 R52 R55 R64 R65 R66 R67 R68 R69 U9